# EAGLE design Blank 48LQFP header (EAGLE 6.4)
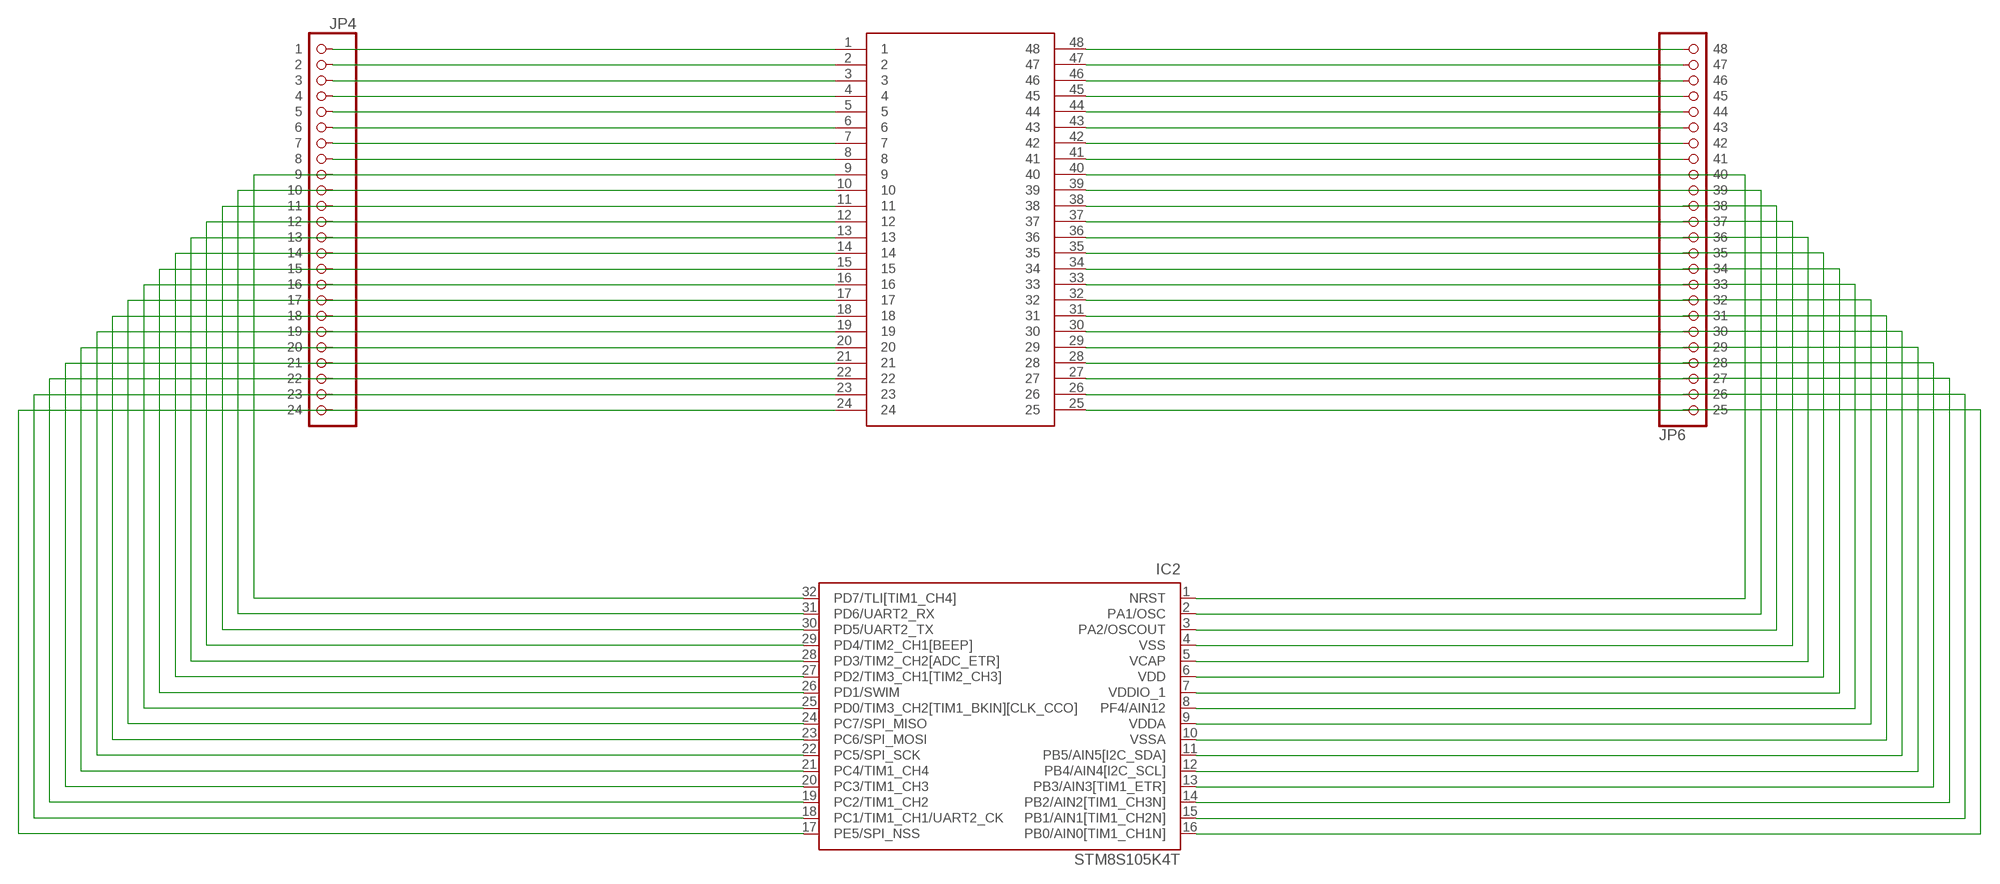
[diagram p0: schematic, sheet 1]

## Parts
IC2  STM8S105K4T  [LQFP32-7X7]
JP4  PINHD-1X241X24_PINS_1_TO_24  [1X24]
JP6  PINHD-1X24-25TO48  [1X24]
U$1  GENERICLQFP48  [TQFP48]

## Nets
N$1: JP4.1 U$1.1
N$2: IC2.9(VDDA) JP6.8 U$1.32
N$3: IC2.1(NRST) JP6.16 U$1.40
N$4: IC2.3(PA2/OSCOUT) JP6.14 U$1.38
N$5: JP4.2 U$1.2
N$6: JP4.3 U$1.3
N$7: JP4.4 U$1.4
N$8: JP4.5 U$1.5
N$9: JP4.6 U$1.6
N$10: JP6.17 U$1.41
N$11: IC2.4(VSS) JP6.13 U$1.37
N$12: JP4.7 U$1.7
N$13: JP4.8 U$1.8
N$14: IC2.31(PD6/UART2_RX) JP4.10 U$1.10
N$15: IC2.24(PC7/SPI_MISO) JP4.17 U$1.17
N$16: IC2.29(PD4/TIM2_CH1[BEEP]) JP4.12 U$1.12
N$17: IC2.28(PD3/TIM2_CH2[ADC_ETR]) JP4.13 U$1.13
N$18: IC2.27(PD2/TIM3_CH1[TIM2_CH3]) JP4.14 U$1.14
N$19: IC2.26(PD1/SWIM) JP4.15 U$1.15
N$20: IC2.25(PD0/TIM3_CH2[TIM1_BKIN][CLK_CCO]) JP4.16 U$1.16
N$21: IC2.30(PD5/UART2_TX) JP4.11 U$1.11
N$22: IC2.22(PC5/SPI_SCK) JP4.19 U$1.19
N$23: IC2.21(PC4/TIM1_CH4) JP4.20 U$1.20
N$24: IC2.20(PC3/TIM1_CH3) JP4.21 U$1.21
N$25: IC2.19(PC2/TIM1_CH2) JP4.22 U$1.22
N$26: IC2.18(PC1/TIM1_CH1/UART2_CK) JP4.23 U$1.23
N$27: IC2.17(PE5/SPI_NSS) JP4.24 U$1.24
N$29: IC2.32(PD7/TLI[TIM1_CH4]) JP4.9 U$1.9
N$30: IC2.16(PB0/AIN0[TIM1_CH1N]) JP6.1 U$1.25
N$31: IC2.15(PB1/AIN1[TIM1_CH2N]) JP6.2 U$1.26
N$32: IC2.14(PB2/AIN2[TIM1_CH3N]) JP6.3 U$1.27
N$33: IC2.13(PB3/AIN3[TIM1_ETR]) JP6.4 U$1.28
N$34: IC2.12(PB4/AIN4[I2C_SCL]) JP6.5 U$1.29
N$35: IC2.11(PB5/AIN5[I2C_SDA]) JP6.6 U$1.30
N$36: IC2.10(VSSA) JP6.7 U$1.31
N$37: IC2.5(VCAP) JP6.12 U$1.36
N$38: IC2.8(PF4/AIN12) JP6.9 U$1.33
N$39: IC2.7(VDDIO_1) JP6.10 U$1.34
N$40: IC2.23(PC6/SPI_MOSI) JP4.18 U$1.18
N$41: JP6.24 U$1.48
N$42: JP6.23 U$1.47
N$43: JP6.22 U$1.46
N$44: JP6.21 U$1.45
N$45: JP6.20 U$1.44
N$46: JP6.19 U$1.43
N$47: JP6.18 U$1.42
N$48: IC2.6(VDD) JP6.11 U$1.35
N$55: IC2.2(PA1/OSC) JP6.15 U$1.39

## Library data of the parts
IC2 = st-microelectronics:STM8S105K: Access line, 16 MHz STM8S 8-bit MCU up to 32 Kbytes Flash, integrated EEPROM,10-bit ADC, timers, UART, SPI, I²C Source: Data sheet <http://www.st.com/stonline/products/literature/ds/14771/stm8s105c4.pdf>; MPN: STM8S105K4T6C; OC_FARNELL: 1706223; OC_NEWARK: 09R6034
JP4 = Liams Library March 2013:PINHD-1X24: PIN HEADER
JP6 = Liams Library March 2013:PINHD-1X24-25TO48: 1x24 header 0.1in pitch labeled for pins 25 to 48
U$1 = Liams Library March 2013:GENERICLQFP48

## Board
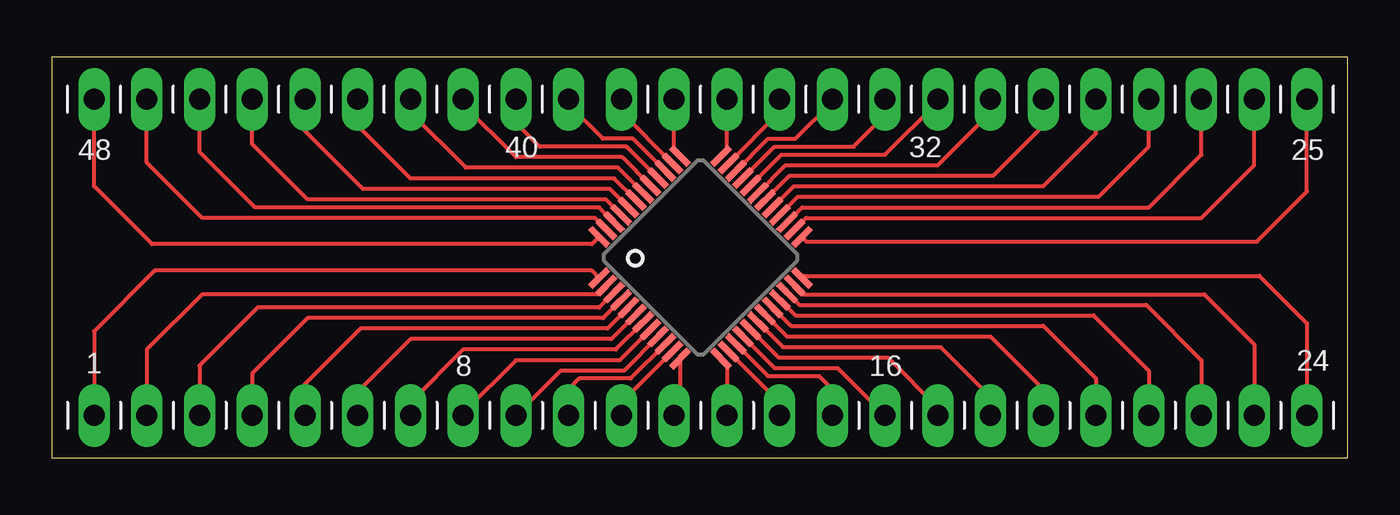
[diagram p1: board, top side]
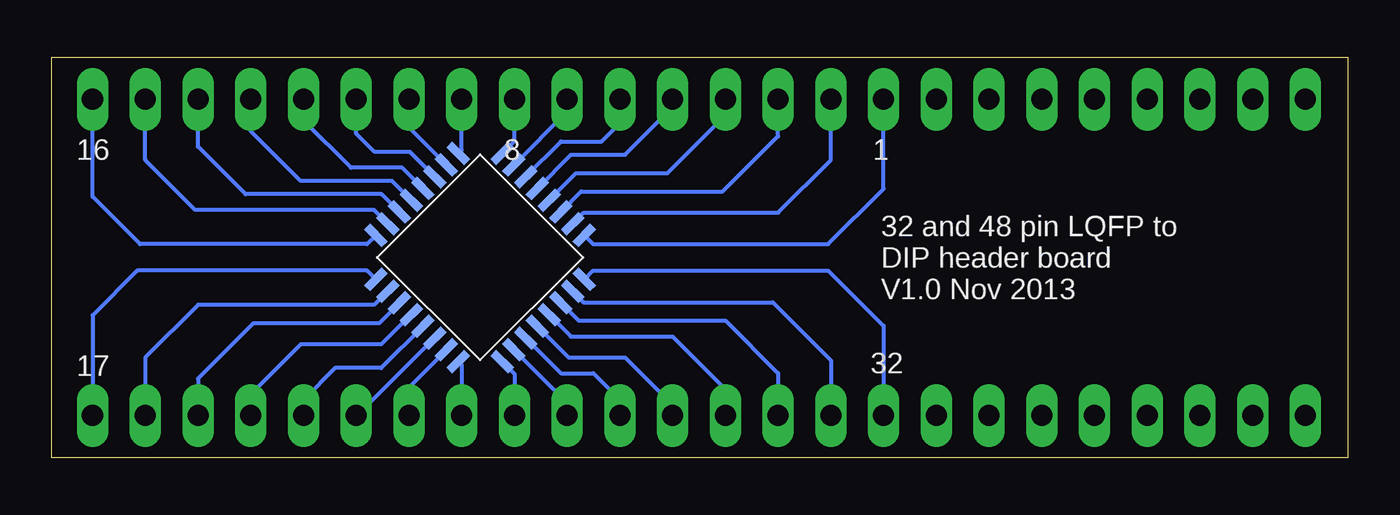
[diagram p2: board, bottom side, seen from below]

Size 62.41 x 19.29 mm. Coordinates in mm from the lower left corner, seen from the top.
Outline: 0,0 62.41,0 62.41,19.29 0,19.29 0,0
Copper layers (1*16): Top 0.0356mm / dielectric 1.5011mm / Bottom 0.0356mm
Design rules "LaenPCBOrder": minimum track width 6mil, minimum drill 13mil, track to track 6mil, track to pad 6mil, pad to pad 6mil, via to via 6mil, smd to smd 6mil, copper to edge 15mil, drill to drill 6mil, minimum pad ring 7mil, minimum via ring 7mil, stop-mask expansion 4mil, vias tented up to drill 0mil, thermal gap 10mil

### Footprints (pad centres in the part's own frame; a part is rotated, then mirrored left to right if it is on the bottom)
LQFP32-7X7 = smd 1.2 x 0.4: 1 -4.3,2.8; 2 -4.3,2; 3 -4.3,1.2; 4 -4.3,0.4; 5 -4.3,-0.4; 6 -4.3,-1.2; 7 -4.3,-2; 8 -4.3,-2.8; 17 4.3,-2.8; 18 4.3,-2; 19 4.3,-1.2; 20 4.3,-0.4; 21 4.3,0.4; 22 4.3,1.2; 23 4.3,2; 24 4.3,2.8 | smd 0.4 x 1.2: 9 -2.8,-4.3; 10 -2,-4.3; 11 -1.2,-4.3; 12 -0.4,-4.3; 13 0.4,-4.3; 14 1.2,-4.3; 15 2,-4.3; 16 2.8,-4.3; 25 2.8,4.3; 26 2,4.3; 27 1.2,4.3; 28 0.4,4.3; 29 -0.4,4.3; 30 -1.2,4.3; 31 -2,4.3; 32 -2.8,4.3
1X24 = drill 1.016 long: 1 -29.21,0; 2 -26.67,0; 3 -24.13,0; 4 -21.59,0; 5 -19.05,0; 6 -16.51,0; 7 -13.97,0; 8 -11.43,0; 9 -8.89,0; 10 -6.35,0; 11 -3.81,0; 12 -1.27,0; 13 1.27,0; 14 3.81,0; 15 6.35,0; 16 8.89,0; 17 11.43,0; 18 13.97,0; 19 16.51,0; 20 19.05,0; 21 21.59,0; 22 24.13,0; 23 26.67,0; 24 29.21,0
TQFP48 = smd 1.2 x 0.3: 1 -4.15,2.75; 2 -4.15,2.25; 3 -4.15,1.75; 4 -4.15,1.25; 5 -4.15,0.75; 6 -4.15,0.25; 7 -4.15,-0.25; 8 -4.15,-0.75; 9 -4.15,-1.25; 10 -4.15,-1.75; 11 -4.15,-2.25; 12 -4.15,-2.75; 25 4.15,-2.75; 26 4.15,-2.25; 27 4.15,-1.75; 28 4.15,-1.25; 29 4.15,-0.75; 30 4.15,-0.25; 31 4.15,0.25; 32 4.15,0.75; 33 4.15,1.25; 34 4.15,1.75; 35 4.15,2.25; 36 4.15,2.75 | smd 0.3 x 1.2: 13 -2.75,-4.15; 14 -2.25,-4.15; 15 -1.75,-4.15; 16 -1.25,-4.15; 17 -0.75,-4.15; 18 -0.25,-4.15; 19 0.25,-4.15; 20 0.75,-4.15; 21 1.25,-4.15; 22 1.75,-4.15; 23 2.25,-4.15; 24 2.75,-4.15; 37 2.75,4.15; 38 2.25,4.15; 39 1.75,4.15; 40 1.25,4.15; 41 0.75,4.15; 42 0.25,4.15; 43 -0.25,4.15; 44 -0.75,4.15; 45 -1.25,4.15; 46 -1.75,4.15; 47 -2.25,4.15; 48 -2.75,4.15

### Placement (x,y rotation side)
IC2  41.78,9.65 225 bottom
JP4  31.24,2.03 0 top
JP6  31.24,17.27 180 top
U$1  31.24,9.65 45 top

### Tracks (layer width: path | path; a pad name or v marks a point on that pad's centre or on a via)
N$1
  Top 0.203: U$1.1 26.01,9.02 4.95,9.02 2.03,6.1 JP4.1
N$2
  Top 0.203: U$1.32 35.13,14.61 40.13,14.61 42.67,17.14 JP6.8
  Bottom 0.203: IC2.9 42.67,14.84 JP6.8
N$3
  Top 0.203: U$1.40 27.68,14.99 23.5,14.99 22.35,16.13 JP6.16
  Bottom 0.203: IC2.1 36.34,10.29 25.02,10.29 22.35,12.95 JP6.16
N$4
  Top 0.203: U$1.38 27.43,16.64 JP6.14
  Bottom 0.203: IC2.3 36.91,12.83 30.1,12.83 27.43,15.49 JP6.14
N$5
  Top 0.203: U$1.2 26.28,7.87 7.24,7.87 4.57,5.21 JP4.2
N$6
  Top 0.203: U$1.3 26.35,7.24 9.91,7.24 7.11,4.45 JP4.3
N$7
  Top 0.203: U$1.4 26.55,6.73 12.32,6.73 9.65,4.06 JP4.4
N$8
  Top 0.203: U$1.5 26.75,6.22 14.86,6.22 12.19,3.56 JP4.5
N$9
  Top 0.203: U$1.6 26.95,5.71 17.27,5.71 14.73,3.17 JP4.6
N$10
  Top 0.203: U$1.41 27.48,14.48 22.35,14.48 19.81,17.02 JP6.17
N$11
  Top 0.203: U$1.37 29.97,14.81 JP6.13
  Bottom 0.203: IC2.4 37.15,13.72 32.77,13.72 29.97,16.51 JP6.13
N$12
  Top 0.203: U$1.7 27.15,5.21 19.81,5.21 17.27,2.67 JP4.7
N$13
  Top 0.203: U$1.8 27.35,4.7 22.35,4.7 19.81,2.16 JP4.8
N$14
  Top 0.203: U$1.10 27.88,3.81 25.4,3.81 24.89,3.3 JP4.10
  Bottom 0.203: IC2.31 36.8,7.49 27.69,7.49 24.89,4.7 JP4.10
N$15
  Top 0.203: U$1.17 35.01,4.83 40.26,4.83 42.67,2.41 JP4.17
  Bottom 0.203: IC2.24 42.67,4.46 JP4.17
N$16
  Top 0.203: U$1.12 30.25,2.31 JP4.12
  Bottom 0.203: IC2.29 37.41,5.84 32.51,5.84 29.97,3.3 JP4.12
N$17
  Top 0.203: U$1.13 32.51,4.49 JP4.13
  Bottom 0.203: IC2.28 37.52,4.83 34.8,4.83 32.51,2.54 JP4.13
N$18
  Top 0.203: U$1.14 35.05,2.66 JP4.14
  Bottom 0.203: IC2.27 37.89,4.06 36.32,4.06 35.05,2.79 JP4.14
N$19
  Top 0.203: U$1.15 34.48,3.94 36.96,3.94 37.59,3.3 JP4.15
  Bottom 0.203: IC2.26 37.59,2.63 JP4.15
N$20
  Top 0.203: U$1.16 34.81,4.32 37.85,4.32 JP4.16
  Bottom 0.203: IC2.25 40.13,4.04 JP4.16
N$21
  Top 0.203: U$1.11 27.43,2.66 JP4.11
  Bottom 0.203: IC2.30 37.04,6.6 29.97,6.6 27.43,4.06 JP4.11
N$22
  Top 0.203: U$1.19 35.41,5.84 45.21,5.84 47.75,3.3 JP4.19
  Bottom 0.203: IC2.22 47.71,2.03 JP4.19
N$23
  Top 0.203: U$1.20 35.6,6.35 47.75,6.35 50.29,3.81 JP4.20
  Bottom 0.203: IC2.21 46.55,4.32 48.77,4.32 50.29,2.79 JP4.20
N$24
  Top 0.203: U$1.21 35.8,6.86 50.16,6.86 52.83,4.19 JP4.21
  Bottom 0.203: IC2.20 46.54,5.46 50.42,5.46 52.83,3.05 JP4.21
N$25
  Top 0.203: U$1.22 36,7.37 52.7,7.37 55.37,4.7 JP4.22
  Bottom 0.203: IC2.19 46.66,6.48 52.7,6.48 55.37,3.81 JP4.22
N$26
  Top 0.203: U$1.23 36.2,7.87 55.5,7.87 57.91,5.46 JP4.23
  Bottom 0.203: IC2.18 46.9,7.37 55.37,7.37 57.91,4.83 JP4.23
N$27
  Top 0.203: U$1.24 36.22,8.76 58.17,8.76 60.45,6.48 JP4.24
  Bottom 0.203: IC2.17 47.23,9.02 58.29,9.02 60.45,6.86 JP4.24
N$29
  Top 0.203: U$1.9 27.55,4.19 24.51,4.19 JP4.9
  Bottom 0.203: IC2.32 36.34,9.02 25.02,9.02 22.35,6.35 JP4.9
N$30
  Top 0.203: U$1.25 36.35,10.41 58.04,10.41 60.45,12.83 JP6.1
  Bottom 0.203: IC2.16 47.23,10.29 58.17,10.29 60.45,12.57 JP6.1
N$31
  Top 0.203: U$1.26 36.33,11.56 55.37,11.56 57.91,14.1 JP6.2
  Bottom 0.203: IC2.15 46.9,11.94 55.5,11.94 57.91,14.35 JP6.2
N$32
  Top 0.203: U$1.27 36.13,12.06 52.83,12.06 55.37,14.61 JP6.3
  Bottom 0.203: IC2.14 46.53,12.7 53.09,12.7 55.37,14.99 JP6.3
N$33
  Top 0.203: U$1.28 35.93,12.57 50.42,12.57 52.83,14.99 JP6.4
  Bottom 0.203: IC2.13 46.03,13.34 50.42,13.34 52.83,15.75 JP6.4
N$34
  Top 0.203: U$1.29 35.73,13.08 47.75,13.08 50.29,15.62 JP6.5
  Bottom 0.203: IC2.12 45.53,13.97 48.01,13.97 50.29,16.26 JP6.5
N$35
  Top 0.203: U$1.30 35.53,13.59 45.34,13.59 47.75,16 JP6.6
  Bottom 0.203: IC2.11 45.17,14.73 46.86,14.73 47.75,15.62 JP6.6
N$36
  Top 0.203: U$1.31 35.33,14.1 42.67,14.1 45.21,16.64 JP6.7
  Bottom 0.203: IC2.10 45.21,15.91 JP6.7
N$37
  Top 0.203: U$1.36 32.51,14.81 JP6.12
  Bottom 0.203: IC2.5 37.4,14.61 34.8,14.61 32.51,16.89 JP6.12
N$38
  Top 0.203: U$1.33 34.81,14.99 38.61,14.99 40.13,16.51 JP6.9
  Bottom 0.203: IC2.8 40.13,15.26 JP6.9
N$39
  Top 0.203: U$1.34 34.48,15.37 35.81,15.37 37.59,17.14 JP6.10
  Bottom 0.203: IC2.7 37.59,16.67 JP6.10
N$40
  Top 0.203: U$1.18 35.21,5.33 42.8,5.33 45.21,2.92 JP4.18
  Bottom 0.203: IC2.23 45.21,3.4 JP4.18
N$41
  Top 0.203: U$1.48 26.01,10.29 4.83,10.29 2.03,13.08 JP6.24
N$42
  Top 0.203: U$1.47 26.16,11.56 7.24,11.56 4.57,14.22 JP6.23
N$43
  Top 0.203: U$1.46 26.35,12.06 9.78,12.06 7.11,14.73 JP6.22
N$44
  Top 0.203: U$1.45 26.68,12.45 12.32,12.45 9.65,15.11 JP6.21
N$45
  Top 0.203: U$1.44 26.88,12.95 14.99,12.95 12.19,15.75 JP6.20
N$46
  Top 0.203: U$1.43 27.08,13.46 17.27,13.46 14.73,16 JP6.19
N$47
  Top 0.203: U$1.42 27.28,13.97 19.94,13.97 17.27,16.64 JP6.18
N$48
  Top 0.203: U$1.35 35.05,16.64 JP6.11
  Bottom 0.203: IC2.6 37.89,15.24 35.94,15.24 35.05,16.13 JP6.11
N$55
  Top 0.203: U$1.39 28,15.37 26.54,15.37 24.89,17.02 JP6.15
  Bottom 0.203: IC2.2 36.8,11.81 27.43,11.81 24.89,14.35 JP6.15

### Text on the board
_tsilk: 48 | 40 | 32 | 25 | 1 | 8 | 16 | 24
_bsilk: 1 | 8 | 16 | 32 and 48 pin LQFP to / DIP header board / V1.0 Nov 2013 | 32 | 17